# Altium schematic sheet sla2216-pull.SchDoc
size A4; DocumentNumber: 6; SheetNumber: 6; SheetTotal: 6
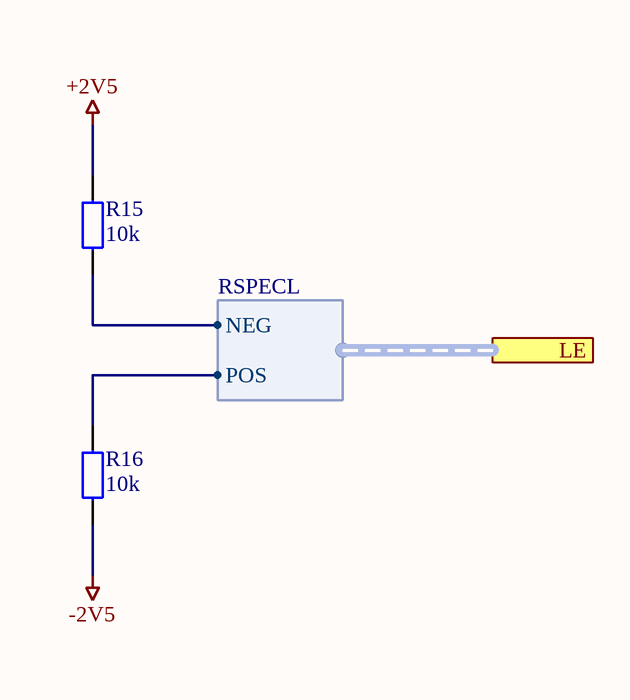
[diagram p0: sla2216-pull.SchDoc]

## Parts
R15  Resistance: 10k  [RES 0603/1608]
R16  Resistance: 10k  [RES 0603/1608]

## Ports
LE (harness RSPECL)

## Harnesses
RSPECL: POS, NEG

## Nets
+2V5: R15.1
-2V5: R16.1
NetR15_2: R15.2 ; port LE.NEG
NetR16_2: R16.2 ; port LE.POS

## Library data of the parts
R15 R16 = Resistor: BOMref: RES_10k_5%_50V_0603; Tolerance: 5%; Voltage Rating: 50V; Package: 0603